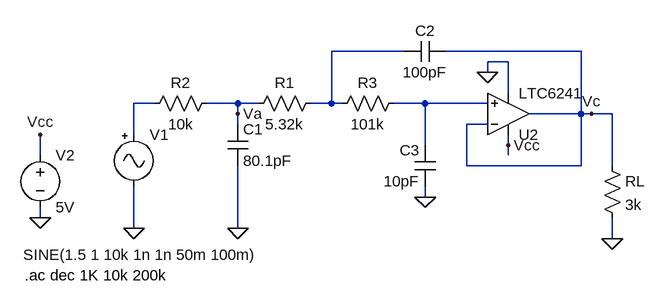
[diagram p0: schematic codec-filter-buffer.asc]
codec-filter-buffer.asc, the LTspice schematic file:
Version 4
SHEET 1 1076 680
WIRE 688 192 576 192
WIRE 960 192 752 192
WIRE 848 208 816 208
WIRE 816 224 816 208
WIRE 848 256 848 208
WIRE 304 272 272 272
WIRE 432 272 384 272
WIRE 464 272 432 272
WIRE 576 272 576 192
WIRE 576 272 544 272
WIRE 592 272 576 272
WIRE 720 272 672 272
WIRE 816 272 720 272
WIRE 432 288 432 272
WIRE 960 288 960 192
WIRE 960 288 880 288
WIRE 976 288 960 288
WIRE 1008 288 976 288
WIRE 432 304 432 288
WIRE 816 304 784 304
WIRE 272 320 272 272
WIRE 720 336 720 272
WIRE 848 336 848 320
WIRE 128 352 128 320
WIRE 848 352 848 336
WIRE 784 368 784 304
WIRE 960 368 960 288
WIRE 960 368 784 368
WIRE 1008 368 1008 288
WIRE 720 416 720 400
WIRE 128 448 128 432
WIRE 272 464 272 400
WIRE 432 464 432 368
WIRE 1008 480 1008 448
FLAG 272 464 0
FLAG 128 448 0
FLAG 128 320 Vcc
FLAG 432 464 0
FLAG 432 288 Va
FLAG 720 416 0
FLAG 976 288 Vc
FLAG 848 336 Vcc
FLAG 816 224 0
FLAG 1008 480 0
SYMBOL res 400 256 R90
WINDOW 0 0 56 VBottom 2
WINDOW 3 32 56 VTop 2
SYMATTR InstName R2
SYMATTR Value 10k
SYMBOL Misc/signal 272 304 R0
WINDOW 3 -170 201 Left 2
SYMATTR Value SINE(1.5 1 10k 1n 1n 50m 100m)
SYMATTR InstName V1
SYMATTR Value2 AC 1 0
SYMBOL voltage 128 336 R0
SYMATTR InstName V2
SYMATTR Value 5V
SYMBOL cap 416 304 R0
SYMATTR InstName C1
SYMATTR Value 80.1pF
SYMBOL res 560 256 R90
WINDOW 0 0 56 VBottom 2
WINDOW 3 32 56 VTop 2
SYMATTR InstName R1
SYMATTR Value 5.32k
SYMBOL res 688 256 R90
WINDOW 0 0 56 VBottom 2
WINDOW 3 32 56 VTop 2
SYMATTR InstName R3
SYMATTR Value 101k
SYMBOL cap 736 400 R180
WINDOW 0 24 56 Left 2
WINDOW 3 24 8 Left 2
SYMATTR InstName C3
SYMATTR Value 10pF
SYMBOL Opamps/LTC6241 848 288 M180
SYMATTR InstName U2
SYMBOL cap 752 176 R90
WINDOW 0 0 32 VBottom 2
WINDOW 3 32 32 VTop 2
SYMATTR InstName C2
SYMATTR Value 100pF
SYMBOL res 992 352 R0
SYMATTR InstName RL
SYMATTR Value 3k
TEXT 104 536 Left 2 !.ac dec 1K 10k 200k

The netlist it stands for:
* codec-filter-buffer.asc
R2 Va N002 10k
V1 N002 0 SINE(1.5 1 10k 1n 1n 50m 100m) AC 1 0
V2 Vcc 0 5V
C1 Va 0 80.1pF
R1 N001 Va 5.32k
R3 N003 N001 101k
C3 0 N003 10pF
XU2 N003 Vc Vcc 0 Vc LTC6241  ; pins In+ In- V+ V- OUT
C2 Vc N001 100pF
RL Vc 0 3k
.ac dec 1K 10k 200k
.lib LTC4.lib
.backanno
.end